# EAGLE schematic energy-management-driver (EAGLE 6.3)
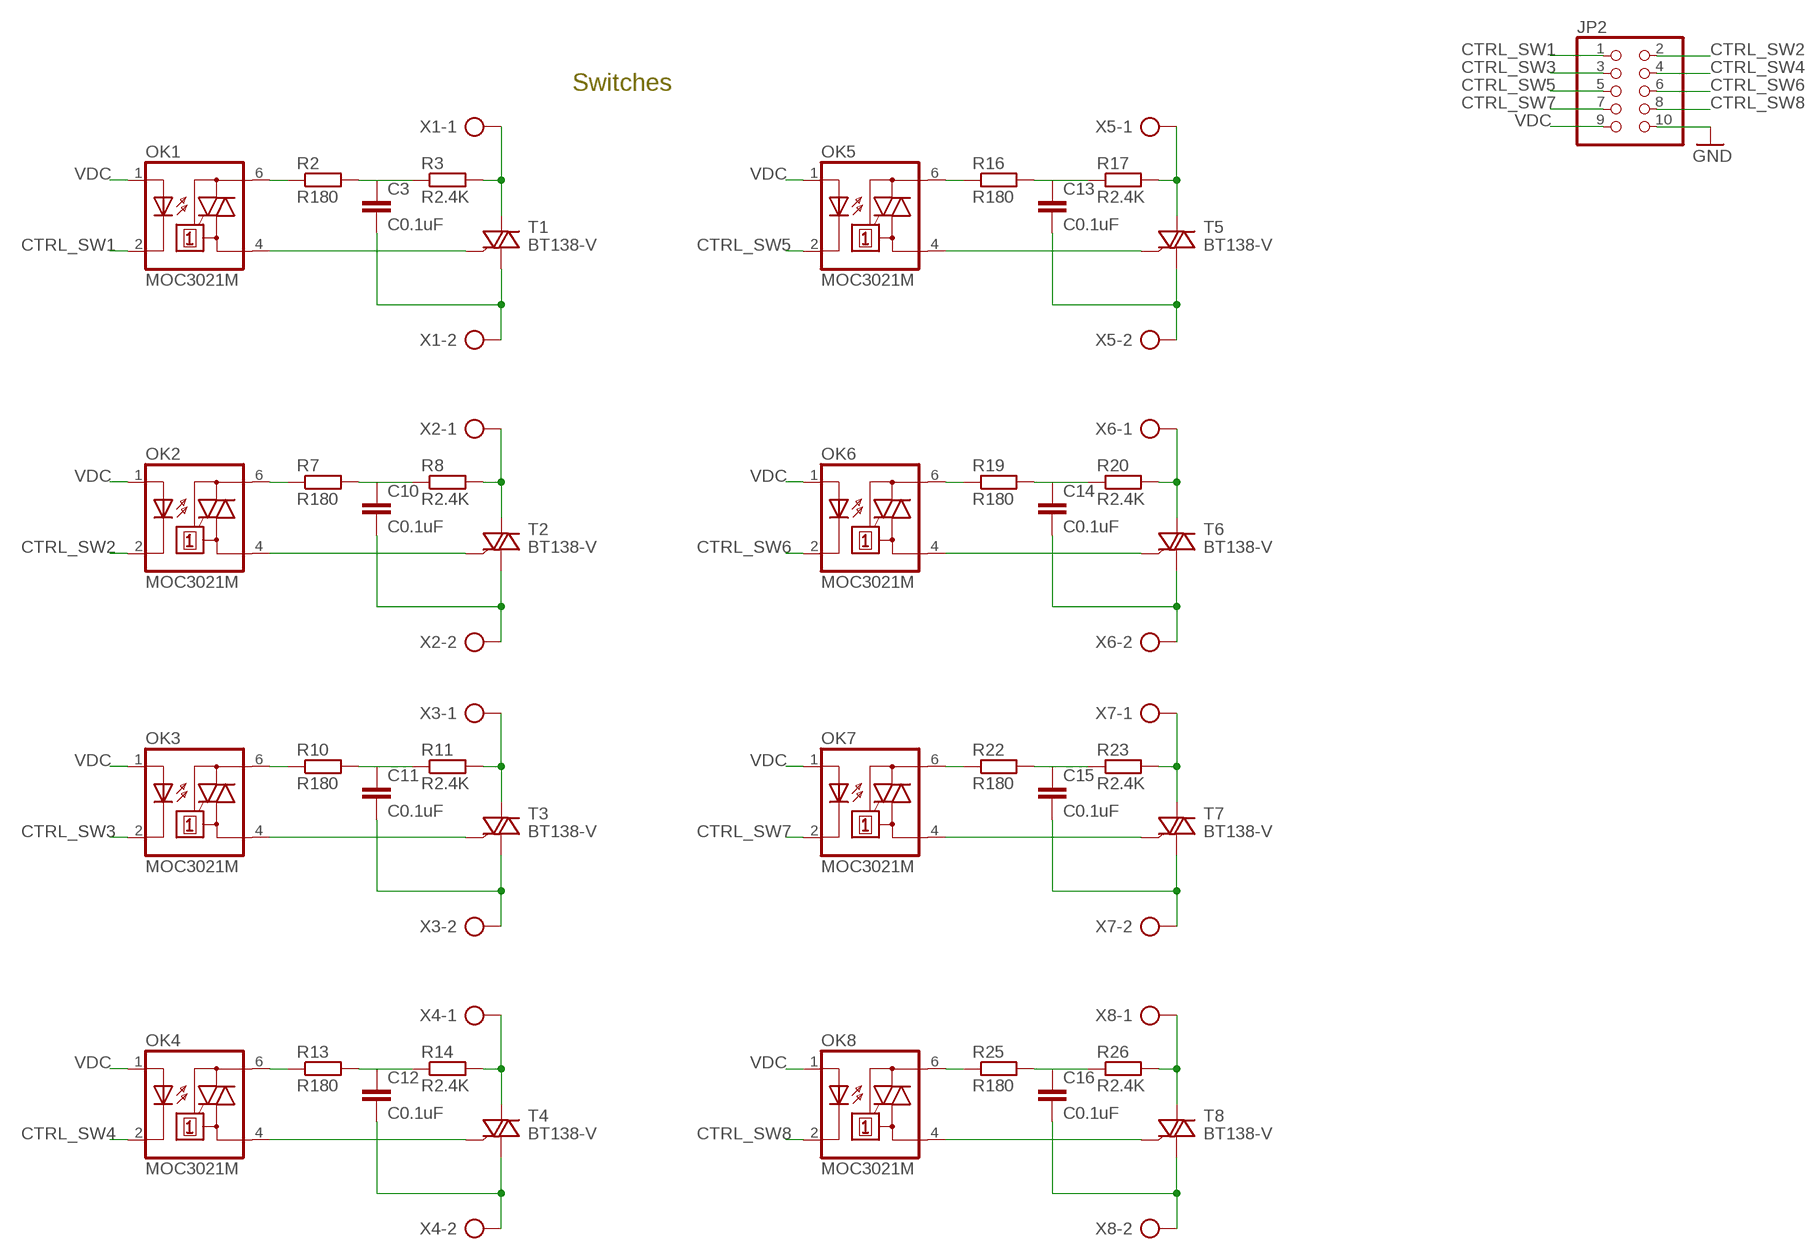
[diagram p0: schematic, sheet 1]

## Parts
C3  C0.1uF  C-EUC0805  [C0805]
C10  C0.1uF  C-EUC0805  [C0805]
C11  C0.1uF  C-EUC0805  [C0805]
C12  C0.1uF  C-EUC0805  [C0805]
C13  C0.1uF  C-EUC0805  [C0805]
C14  C0.1uF  C-EUC0805  [C0805]
C15  C0.1uF  C-EUC0805  [C0805]
C16  C0.1uF  C-EUC0805  [C0805]
JP2  PINHD-2X5  [2X05]
OK1  MOC3021M  [DIL06]
OK2  MOC3021M  [DIL06]
OK3  MOC3021M  [DIL06]
OK4  MOC3021M  [DIL06]
OK5  MOC3021M  [DIL06]
OK6  MOC3021M  [DIL06]
OK7  MOC3021M  [DIL06]
OK8  MOC3021M  [DIL06]
R2  R180  R-EU_M0805  [M0805]
R3  R2.4K  R-EU_M0805  [M0805]
R7  R180  R-EU_M0805  [M0805]
R8  R2.4K  R-EU_M0805  [M0805]
R10  R180  R-EU_M0805  [M0805]
R11  R2.4K  R-EU_M0805  [M0805]
R13  R180  R-EU_M0805  [M0805]
R14  R2.4K  R-EU_M0805  [M0805]
R16  R180  R-EU_M0805  [M0805]
R17  R2.4K  R-EU_M0805  [M0805]
R19  R180  R-EU_M0805  [M0805]
R20  R2.4K  R-EU_M0805  [M0805]
R22  R180  R-EU_M0805  [M0805]
R23  R2.4K  R-EU_M0805  [M0805]
R25  R180  R-EU_M0805  [M0805]
R26  R2.4K  R-EU_M0805  [M0805]
T1  BT138-V  [TO220BV]
T2  BT138-V  [TO220BV]
T3  BT138-V  [TO220BV]
T4  BT138-V  [TO220BV]
T5  BT138-V  [TO220BV]
T6  BT138-V  [TO220BV]
T7  BT138-V  [TO220BV]
T8  BT138-V  [TO220BV]
X1  AK300/2  [AK300/2]
X2  AK300/2  [AK300/2]
X3  AK300/2  [AK300/2]
X4  AK300/2  [AK300/2]
X5  AK300/2  [AK300/2]
X6  AK300/2  [AK300/2]
X7  AK300/2  [AK300/2]
X8  AK300/2  [AK300/2]

## Nets
CTRL_SW1: JP2.1 OK1.2(C)
CTRL_SW2: JP2.2 OK2.2(C)
CTRL_SW3: JP2.3 OK3.2(C)
CTRL_SW4: JP2.4 OK4.2(C)
CTRL_SW5: JP2.5 OK5.2(C)
CTRL_SW6: JP2.6 OK6.2(C)
CTRL_SW7: JP2.7 OK7.2(C)
CTRL_SW8: JP2.8 OK8.2(C)
GND: JP2.10
N$3: OK1.6(A2) R2.1
N$4: C3.1 R2.2 R3.1
N$5: OK1.4(A1) T1.G
N$6: C3.2 T1.T1(A1) X1.2
N$9: R3.2 T1.T2(A2) X1.1
N$12: OK2.6(A2) R7.1
N$13: C10.1 R7.2 R8.1
N$14: OK2.4(A1) T2.G
N$15: C10.2 T2.T1(A1) X2.2
N$18: OK3.6(A2) R10.1
N$19: C11.1 R10.2 R11.1
N$20: OK3.4(A1) T3.G
N$21: C11.2 T3.T1(A1) X3.2
N$24: OK4.6(A2) R13.1
N$25: C12.1 R13.2 R14.1
N$26: OK4.4(A1) T4.G
N$27: C12.2 T4.T1(A1) X4.2
N$30: OK5.6(A2) R16.1
N$31: C13.1 R16.2 R17.1
N$32: OK5.4(A1) T5.G
N$33: C13.2 T5.T1(A1) X5.2
N$36: OK6.6(A2) R19.1
N$37: C14.1 R19.2 R20.1
N$38: OK6.4(A1) T6.G
N$39: C14.2 T6.T1(A1) X6.2
N$42: OK7.6(A2) R22.1
N$43: C15.1 R22.2 R23.1
N$44: OK7.4(A1) T7.G
N$45: C15.2 T7.T1(A1) X7.2
N$48: OK8.6(A2) R25.1
N$49: C16.1 R25.2 R26.1
N$50: OK8.4(A1) T8.G
N$51: C16.2 T8.T1(A1) X8.2
N$52: R8.2 T2.T2(A2) X2.1
N$53: R11.2 T3.T2(A2) X3.1
N$54: R14.2 T4.T2(A2) X4.1
N$55: R26.2 T8.T2(A2) X8.1
N$56: R23.2 T7.T2(A2) X7.1
N$57: R20.2 T6.T2(A2) X6.1
N$58: R17.2 T5.T2(A2) X5.1
VDC: JP2.9 OK1.1(A) OK2.1(A) OK3.1(A) OK4.1(A) OK5.1(A) OK6.1(A) OK7.1(A) OK8.1(A)

## Notes on the sheet
- Switches

## Library data of the parts
C3 C10-C16 = resistor:C-EU: CAPACITOR, European symbol
JP2 = pinhead:PINHD-2X5: PIN HEADER
OK1-OK8 = optocoupler:MOC30*M: RANDOM-PHASE OPTOISOLATORS TRIAC DRIVER OUTPUT Source: http://www.fairchildsemi.com MOC3020-M.pdf; MF: FAIRCHILD SEMICONDUCTOR; MPN: MOC3021-M; OC_FARNELL: 1021365; OC_NEWARK: 95B7895
R2 R3 R7 R8 R10 R11 R13 R14 R16 R17 R19 R20 R22 R23 R25 R26 = resistor:R-EU_: RESISTOR, European symbol
T1-T8 = triac:BT138: TRIAC Source: http://www.semiconductors.philips.com BT138_SERIES_2.pdf
X1-X8 = con-ptr500:AK300/2: CONNECTOR; OC_FARNELL: unknown; OC_NEWARK: unknown